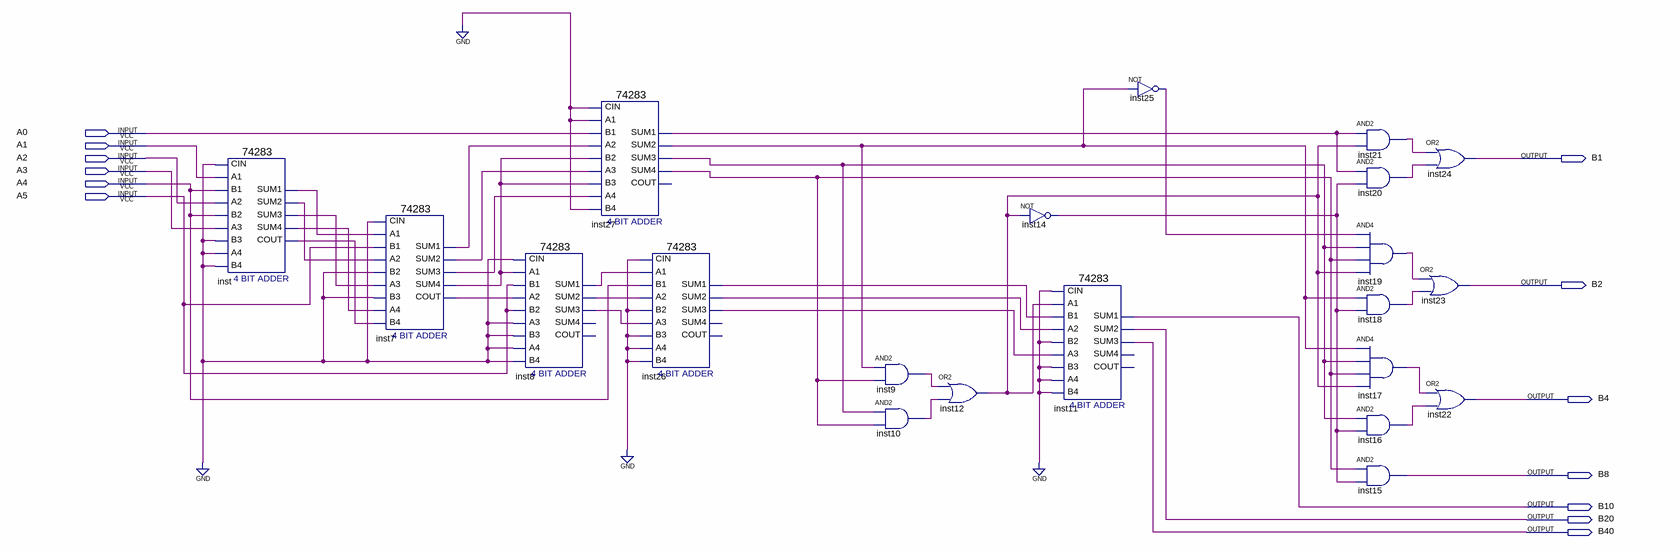
[diagram p0: schematic sheet]
// Quartus schematic binaryToBCD.bdf as structural Verilog: 21 symbols, 13 pins
module binaryToBCD (
  input  A0,
  input  A1,
  input  A2,
  input  A3,
  input  A4,
  input  A5,
  output B1,
  output B2,
  output B4,
  output B8,
  output B10,
  output B20,
  output B40
);

  wire inst7_cout, inst7_sum1, inst7_sum2, inst7_sum3, inst7_sum4, inst8_sum1, inst8_sum2, inst8_sum3,
       inst9_out, inst10_out, inst12_out, inst14_out, inst16_out, inst17_out, inst18_out, inst19_out,
       inst20_out, inst21_out, inst25_out, inst26_sum1, inst26_sum2, inst26_sum3, inst27_sum1, inst27_sum2,
       inst27_sum3, inst27_sum4, inst_cout, inst_sum1, inst_sum2, inst_sum3, inst_sum4;

  \74283  inst (
    .CIN(1'b0), .A1(A1), .A2(A2), .B2(A4), .A3(A3), .A4(1'b0), .B4(1'b0), .B1(A4), .B3(1'b0),
    .SUM4(inst_sum4), .COUT(inst_cout), .SUM1(inst_sum1), .SUM2(inst_sum2), .SUM3(inst_sum3));
  \74283  inst7 (
    .CIN(1'b0), .A1(inst_sum1), .A2(inst_sum2), .B2(1'b0), .A3(inst_sum3), .A4(inst_sum4), .B4(inst_cout),
    .B1(A5), .B3(1'b0), .SUM4(inst7_sum4), .COUT(inst7_cout), .SUM1(inst7_sum1), .SUM2(inst7_sum2),
    .SUM3(inst7_sum3));
  \74283  inst8 (
    .CIN(1'b0), .A1(inst7_sum4), .A2(inst7_cout), .B2(A5), .A3(1'b0), .A4(1'b0), .B4(1'b0), .B1(A5),
    .B3(1'b0), .SUM1(inst8_sum1), .SUM2(inst8_sum2), .SUM3(inst8_sum3));  // open: SUM4, COUT
  \74283  inst27 (
    .CIN(1'b0), .A1(1'b0), .A2(inst7_sum1), .B2(inst7_sum4), .A3(inst7_sum2), .A4(inst7_sum3), .B4(1'b0),
    .B1(A0), .B3(inst7_sum4), .SUM4(inst27_sum4), .SUM1(inst27_sum1), .SUM2(inst27_sum2), .SUM3(inst27_sum3));  // open: COUT
  \74283  inst26 (
    .CIN(1'b0), .A1(inst8_sum1), .A2(inst8_sum2), .B2(1'b0), .A3(inst8_sum3), .A4(1'b0), .B4(1'b0), .B1(A4),
    .B3(1'b0), .SUM1(inst26_sum1), .SUM2(inst26_sum2), .SUM3(inst26_sum3));  // open: SUM4, COUT
  and inst9 (inst9_out, inst27_sum2, inst27_sum4);
  and inst10 (inst10_out, inst27_sum3, inst27_sum4);
  or inst12 (inst12_out, inst9_out, inst10_out);
  not inst14 (inst14_out, inst12_out);
  \74283  inst11 (
    .CIN(1'b0), .A1(inst12_out), .A2(inst26_sum2), .B2(1'b0), .A3(inst26_sum3), .A4(1'b0), .B4(1'b0),
    .B1(inst26_sum1), .B3(1'b0), .SUM1(B10), .SUM2(B20), .SUM3(B40));  // open: SUM4, COUT
  not inst25 (inst25_out, inst27_sum2);
  and inst21 (inst21_out, inst27_sum1, inst12_out);
  and inst20 (inst20_out, inst27_sum1, inst14_out);
  and inst19 (inst19_out, inst25_out, inst27_sum3, inst27_sum4, inst12_out);
  and inst18 (inst18_out, inst27_sum2, inst14_out);
  and inst17 (inst17_out, inst27_sum2, inst27_sum3, inst27_sum4, inst12_out);
  and inst16 (inst16_out, inst27_sum3, inst14_out);
  and inst15 (B8, inst27_sum4, inst14_out);
  or inst24 (B1, inst21_out, inst20_out);
  or inst23 (B2, inst19_out, inst18_out);
  or inst22 (B4, inst17_out, inst16_out);
endmodule
